# Altium schematic sheet Barreira_pacote.SchDoc: CONTROLADORA MAIS PIPOCA - REVISÃO EMC
size A3; DocumentNumber: 3; SheetNumber: 3; SheetTotal: 17
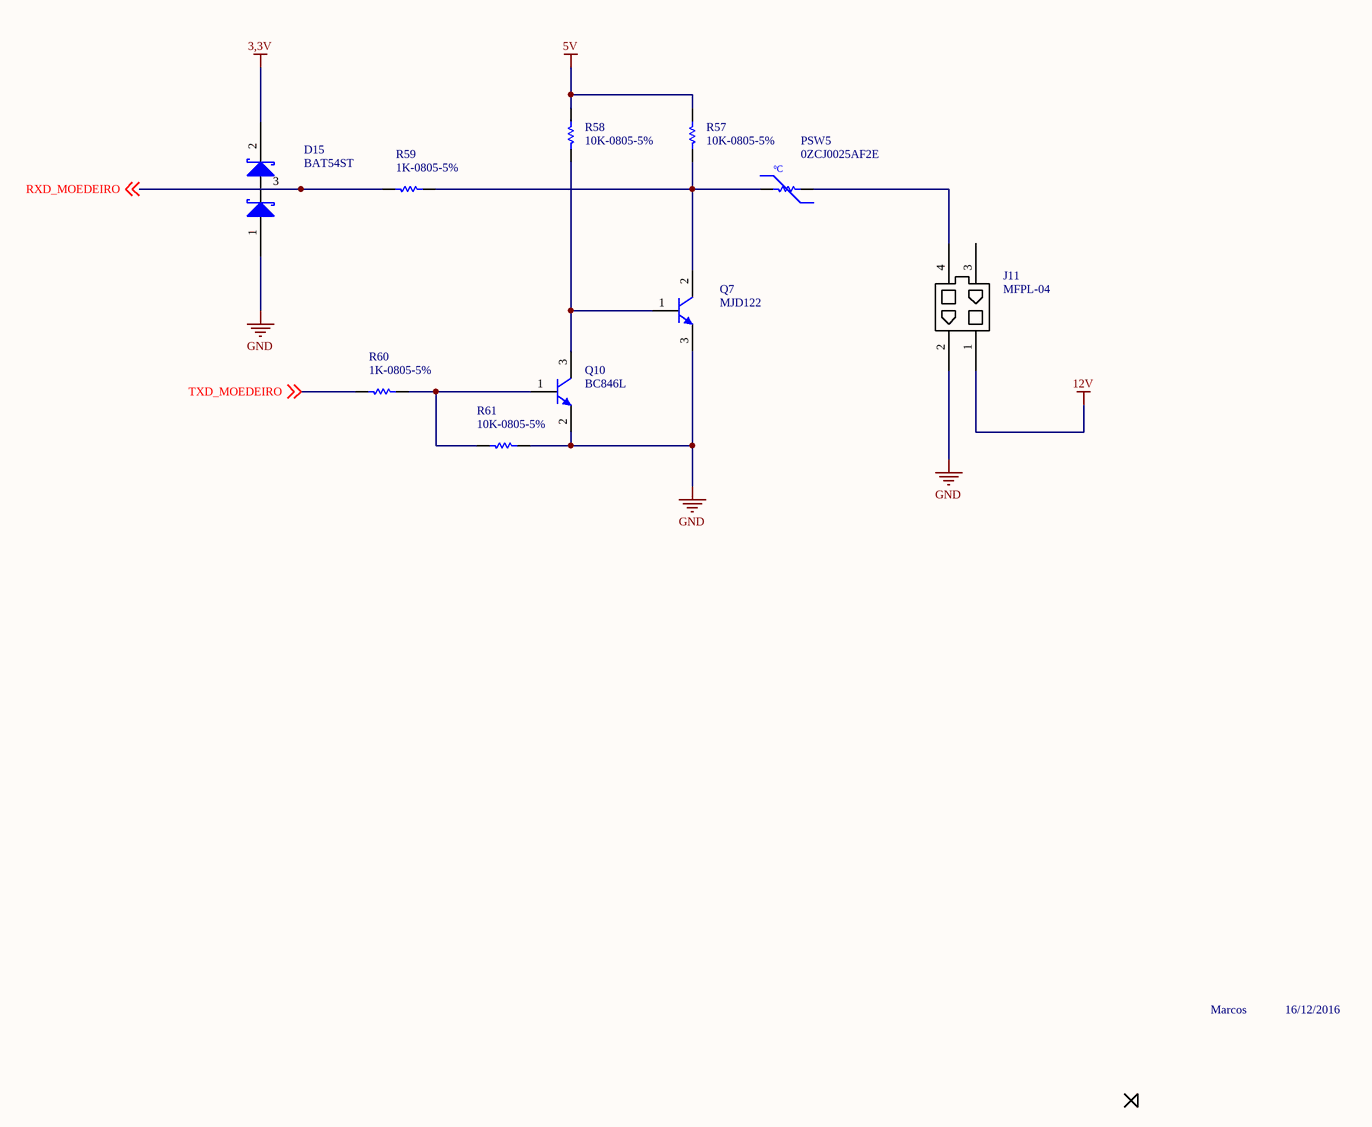
[diagram p0: Barreira_pacote.SchDoc]

## Parts
D15  BAT54ST  [SOT23 - REVISADO ONDA]
J11  MFPL-04
PSW5  0ZCJ0025AF2E  [1206-REVISADO ONDA]
Q7  MJD122  [DPAK REVISADO ONDA]
Q10  BC846L  [SOT23 - REVISADO ONDA]
R57  10K-0805-5%  [0805-REVISADO ONDA]
R58  10K-0805-5%  [0805-REVISADO ONDA]
R59  1K-0805-5%  [0805-REVISADO ONDA]
R60  1K-0805-5%  [0805-REVISADO ONDA]
R61  10K-0805-5%  [0805-REVISADO ONDA]

## Nets
3,3V: D15.2
5V: R57.2 R58.2
12V: J11.1
GND: D15.1 J11.2 Q7.3(E) Q10.2(E) R61.1
RXD_MOEDEIRO: D15.3 R59.2 ; off-sheet RXD_MOEDEIRO
TXD_MOEDEIRO: R60.2 ; off-sheet TXD_MOEDEIRO
NetJ11_4: J11.4 PSW5.1
NetPSW5_2: PSW5.2 Q7.2(C) R57.1 R59.1
NetQ7_1: Q7.1(B) Q10.3(C) R58.1
NetQ10_1: Q10.1(B) R60.1 R61.2

Not connected (* = marked no-connect by the designer): J11 3

## Notes on the sheet
- Marcos
- 16/12/2016
- NOME
- DATA
- PROJETO
- DESCRIÇÃO
- desenho
- verif.
- aprov.
- TAMANHO
- CODIGO
- Todas as informações disponíveis
- não devem ser divulgadas,
- em parte ou todo.
- www.quarktee.com.br
- CIRCUITO IMPRESSO
- MONTAGEM ELETRÔNICA
- A4
- de
- (in symbol PTC 2A-120V) ºC

## Library data of the parts
PSW5 = PTC 2A-120V
Q7 = MJD31
Q10 = BC846: ERP: 106.22.001
R57 R58 R61 = 10K-0805-5%: ERP: 102.11.054
R59 R60 = 1K-0805-5%: ERP: 102.11.042